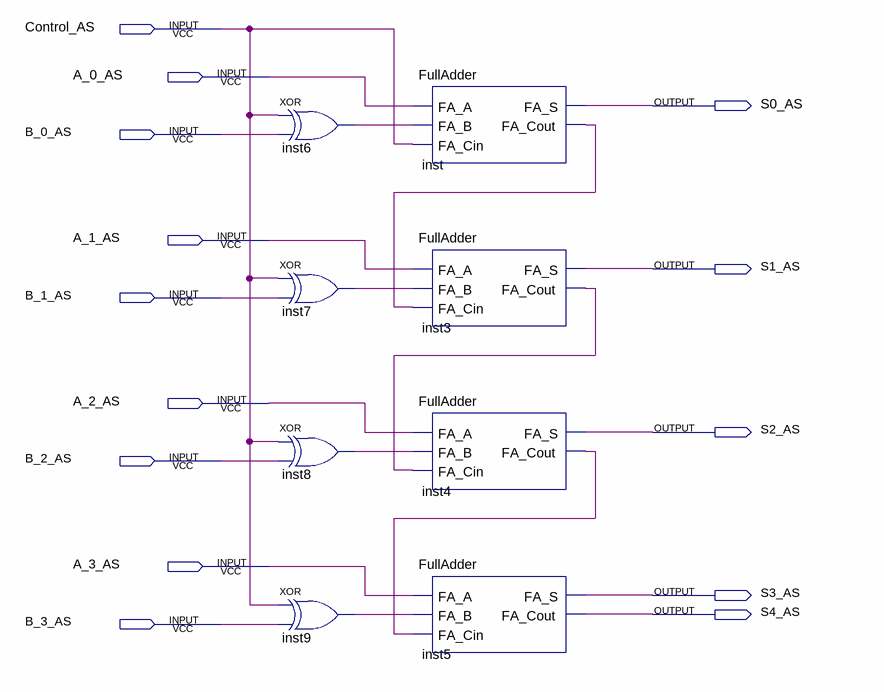
[diagram p0: schematic sheet]
// Quartus schematic Adder_Subtractor.bdf as structural Verilog: 8 symbols, 14 pins
module Adder_Subtractor (
  input  Control_AS,
  input  A_0_AS,
  input  B_0_AS,
  input  A_1_AS,
  input  B_1_AS,
  input  A_2_AS,
  input  B_2_AS,
  input  A_3_AS,
  input  B_3_AS,
  output S0_AS,
  output S1_AS,
  output S2_AS,
  output S3_AS,
  output S4_AS
);

  wire inst3_fa_cout, inst4_fa_cout, inst6_out, inst7_out, inst8_out, inst9_out, inst_fa_cout;

  xor inst6 (inst6_out, Control_AS, B_0_AS);
  xor inst7 (inst7_out, Control_AS, B_1_AS);
  xor inst8 (inst8_out, Control_AS, B_2_AS);
  xor inst9 (inst9_out, Control_AS, B_3_AS);
  FullAdder inst (.FA_A(A_0_AS), .FA_B(inst6_out), .FA_Cin(Control_AS), .FA_S(S0_AS), .FA_Cout(inst_fa_cout));
  FullAdder inst3 (.FA_A(A_1_AS), .FA_B(inst7_out), .FA_Cin(inst_fa_cout), .FA_S(S1_AS), .FA_Cout(inst3_fa_cout));
  FullAdder inst4 (.FA_A(A_2_AS), .FA_B(inst8_out), .FA_Cin(inst3_fa_cout), .FA_S(S2_AS), .FA_Cout(inst4_fa_cout));
  FullAdder inst5 (.FA_A(A_3_AS), .FA_B(inst9_out), .FA_Cin(inst4_fa_cout), .FA_S(S3_AS), .FA_Cout(S4_AS));
endmodule
